# Altium schematic sheet BM22192DA06_SCH.SchDoc
size 594 x 420 mm; SheetNumber: 1; SheetTotal: 1
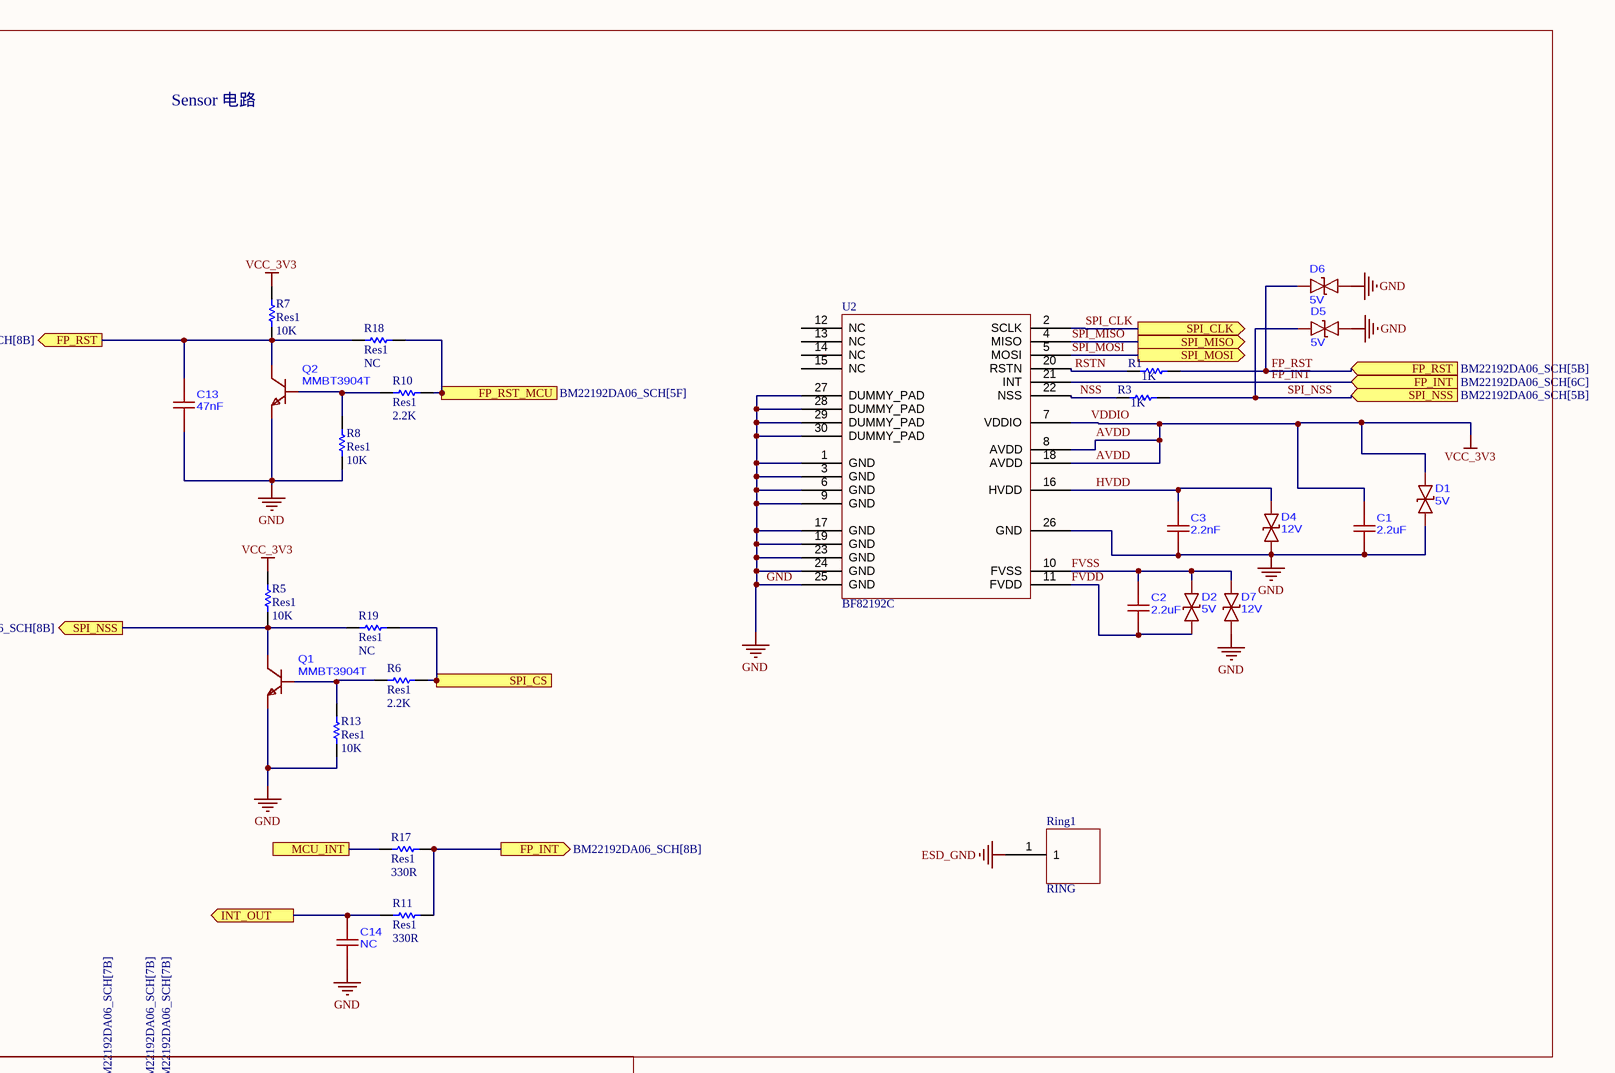
[diagram p0: BM22192DA06_SCH.SchDoc, top right]
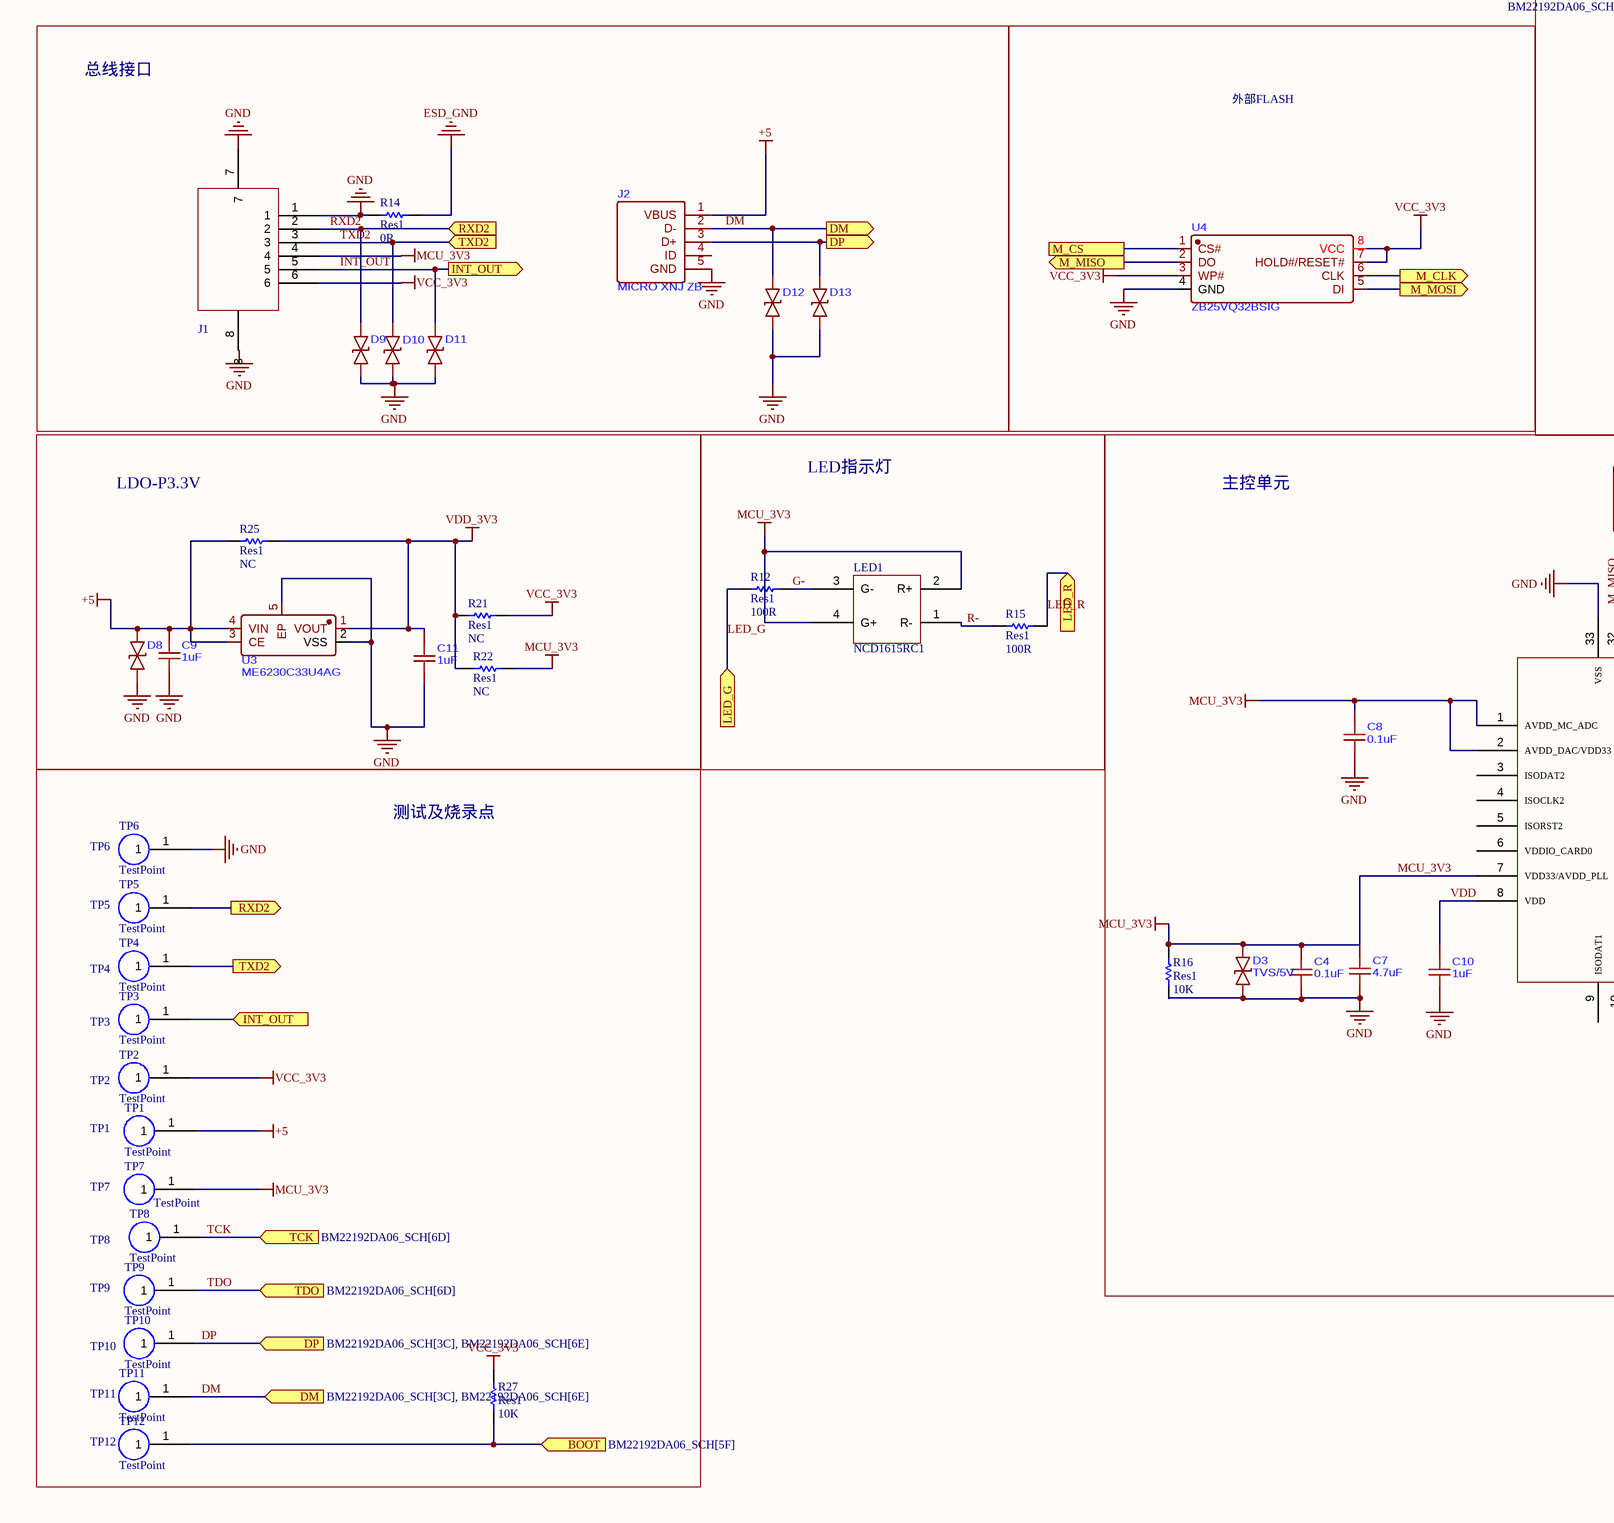
[diagram p1: BM22192DA06_SCH.SchDoc, bottom left]
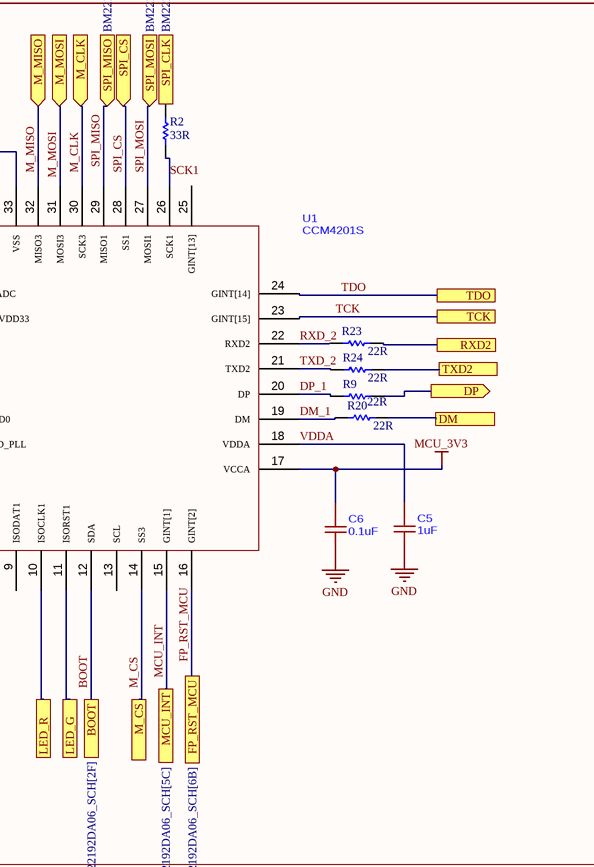
[diagram p2: BM22192DA06_SCH.SchDoc, bottom right]

## Parts
C1  2.2uF  [C0201]
C2  2.2uF  [C0201]
C3  2.2nF  [C0201]
C4  0.1uF  [C0201]
C5  1uF  [C0402]
C6  0.1uF  [C0201]
C7  4.7uF  [C0402]
C8  0.1uF  [C0201]
C9  1uF  [C0402]
C10  1uF  [C0402]
C11  1uF  [C0402]
C13  47nF  [C0201]
C14  NC  [C0201]
D1  5V  [D0201-BI_A]
D2  5V  [D0201-BI_A]
D3  TVS/5V  [D0201-BI_A]
D4  12V  [D0201-BI_A]
D5  5V  [D0201-BI_A]
D6  5V  [D0201-BI_A]
D7  12V  [D0201-BI_A]
D8  RSFK9D3NT  [D0201-BI_A]  (value not drawn)
D9  RSFK9D3NT  [D0201-BI_A]  (value not drawn)
D10  RSFK9D3NT  [D0201-BI_A]  (value not drawn)
D11  RSFK9D3NT  [D0201-BI_A]  (value not drawn)
D12  RSFK9D3NT  [D0201-BI_A]  (value not drawn)
D13  RSFK9D3NT  [D0201-BI_A]  (value not drawn)
J1  SM06B-GHS-TB(LF)(SN)  [CONN_SM06B-GHS-TB_JST]  (value not drawn)
J2  MICRO XNJ ZB  [MICRO-USB-SMD_MICRO-XNJ-ZB]
LED1  NCD1615RC1  [LED-SMD_4P-L1.6-W1.5-TL-1]
Q1  MMBT3904T  [SOT-523-3_L1.6-W0.8-P1.00-LS1.6-BR]
Q2  MMBT3904T  [SOT-523-3_L1.6-W0.8-P1.00-LS1.6-BR]
R1  value 1K  [R0201]  (hidden comment: Res1)
R2  value 33R  [R0201]  (hidden comment: Res1)
R3  value 1K  [R0201]  (hidden comment: Res1)
R5  Res1  value 10K  [R0201]
R6  Res1  value 2.2K  [R0201]
R7  Res1  value 10K  [R0201]
R8  Res1  value 10K  [R0201]
R9  value 22R  [R0201]  (hidden comment: Res1)
R10  Res1  value 2.2K  [R0201]
R11  Res1  value 330R  [R0201]
R12  Res1  value 100R  [R0201]
R13  Res1  value 10K  [R0201]
R14  Res1  value 0R  [R0201]
R15  Res1  value 100R  [R0201]
R16  Res1  value 10K  [R0201]
R17  Res1  value 330R  [R0201]
R18  Res1  value NC  [R0201]
R19  Res1  value NC  [R0201]
R20  value 22R  [R0201]  (hidden comment: Res1)
R21  Res1  value NC  [R0201]
R22  Res1  value NC  [R0201]
R23  value 22R  [R0201]  (hidden comment: Res1)
R24  value 22R  [R0201]  (hidden comment: Res1)
R25  Res1  value NC  [R0201]
R27  Res1  value 10K  [R0201]
Ring1  RING  [金属环]
TP1  TestPoint  [TestPoint]
TP2  TestPoint  [TestPoint]
TP3  TestPoint  [TestPoint]
TP4  TestPoint  [TestPoint]
TP5  TestPoint  [TestPoint]
TP6  TestPoint  [TestPoint]
TP7  TestPoint  [TestPoint]
TP8  TestPoint  [TestPoint]
TP9  TestPoint  [TestPoint]
TP10  TestPoint  [TestPoint]
TP11  TestPoint  [TestPoint]
TP12  TestPoint  [TestPoint]
U1  CCM4201S  [QFN40P400X400X85_HS-33N]
U2  BF82192C  [BF82192c]
U3  ME6230C33U4AG  [FBP4L_L1.0-W1.0-P0.65-BL-EP]
U4  ZB25VQ32BSIG  [SOIJ-8_L5.3-W5.3-P1.27-LS7.9-BL]

## Blocks framed on the sheet
Sensor 电路: C1-C3 C13 C14 D1 D2 D4-D7 Q1 Q2 R1 R3 R5-R8 R10 R11 R13 R17-R19 Ring1 U2
总线接口: D9-D13 J1 J2 R14
外部FLASH: U4
LDO-P3.3V: C9 C11 D8 R21 R22 R25 U3
LED指示灯: LED1 R12 R15
主控单元: C4-C8 C10 D3 R2 R9 R16 R20 R23 R24 U1
测试及烧录点: R27 TP1-TP12

## Ports
BOOT (in, see BM22192DA06_SCH[5F]), BOOT (see BM22192DA06_SCH[2F]), DM (in, see BM22192DA06_SCH[3C], BM22192DA06_SCH[6E]), DM (out, see BM22192DA06_SCH[1F], BM22192DA06_SCH[6E]), DM (see BM22192DA06_SCH[1F], BM22192DA06_SCH[3C]), DP (in, see BM22192DA06_SCH[3C], BM22192DA06_SCH[6E]), DP (out, see BM22192DA06_SCH[1F], BM22192DA06_SCH[3C]), DP (out, see BM22192DA06_SCH[1F], BM22192DA06_SCH[6E]), FP_INT (in, see BM22192DA06_SCH[6C]), FP_INT (out, see BM22192DA06_SCH[8B]), FP_RST (in, see BM22192DA06_SCH[5B]), FP_RST (out, see BM22192DA06_SCH[8B]), FP_RST_MCU (see BM22192DA06_SCH[5F]), FP_RST_MCU (see BM22192DA06_SCH[6B]), INT_OUT (in, see BM22192DA06_SCH[2C], BM22192DA06_SCH[5C]), INT_OUT (out, see BM22192DA06_SCH[1E], BM22192DA06_SCH[2C]), INT_OUT (out, see BM22192DA06_SCH[1E], BM22192DA06_SCH[5C]), LED_G (in, see BM22192DA06_SCH[5F]), LED_G (see BM22192DA06_SCH[2D]), LED_R (in, see BM22192DA06_SCH[5F]), LED_R (see BM22192DA06_SCH[3D]), M_CLK (in, see BM22192DA06_SCH[4C]), M_CLK (out, see BM22192DA06_SCH[5D]), M_CS (see BM22192DA06_SCH[3C]), M_CS (see BM22192DA06_SCH[5F]), M_MISO (in, see BM22192DA06_SCH[3C]), M_MISO (out, see BM22192DA06_SCH[5D]), M_MOSI (in, see BM22192DA06_SCH[4C]), M_MOSI (out, see BM22192DA06_SCH[5D]), MCU_INT (see BM22192DA06_SCH[5C]), MCU_INT (see BM22192DA06_SCH[5F]), RXD2 (in, see BM22192DA06_SCH[1E], BM22192DA06_SCH[6E]), RXD2 (out, see BM22192DA06_SCH[2C], BM22192DA06_SCH[6E]), RXD2 (see BM22192DA06_SCH[1E], BM22192DA06_SCH[2C]), SPI_CLK (in, see BM22192DA06_SCH[7B]), SPI_CLK (out, see BM22192DA06_SCH[5D]), SPI_CS (in, see BM22192DA06_SCH[6C]), SPI_CS (out, see BM22192DA06_SCH[5D]), SPI_MISO (in, see BM22192DA06_SCH[7B]), SPI_MISO (out, see BM22192DA06_SCH[5D]), SPI_MOSI (in, see BM22192DA06_SCH[7B]), SPI_MOSI (out, see BM22192DA06_SCH[5D]), SPI_NSS (in, see BM22192DA06_SCH[5B]), SPI_NSS (out, see BM22192DA06_SCH[8B]), TCK (in, see BM22192DA06_SCH[6D]), TCK (see BM22192DA06_SCH[1F]), TDO (in, see BM22192DA06_SCH[6D]), TDO (see BM22192DA06_SCH[1F]), TXD2 (in, see BM22192DA06_SCH[1E], BM22192DA06_SCH[6E]), TXD2 (out, see BM22192DA06_SCH[2C], BM22192DA06_SCH[6E]), TXD2 (see BM22192DA06_SCH[1E], BM22192DA06_SCH[2C])

## Nets
+5: C9.2 D8.2(A) J2.1(VBUS) R25.1 TP1.1 U3.3(CE) U3.4(VIN)
AVDD: C1.2 D1.1(K) J1.6 R5.1 R7.1 R21.2 R27.2 TP2.1 U2.7(VDDIO) U2.8(AVDD) U2.18(AVDD) U4.3(WP#) U4.7(HOLD#/RESET#) U4.8(VCC)  [also labelled VCC_3V3, VDDIO]
ESD_GND: R14.2 Ring1.1
GND: C1.1 C3.1 C4.1 C5.1 C6.1 C7.1 C8.1 C9.1 C10.1 C11.1 C13.1 C14.1 D1.2(A) D3.1(K) D4.1(K) D5.1(K) D6.1(K) D7.1(K) D8.1(K) D9.1(K) D10.2(A) D11.2(A) D12.1(K) D13.1(K) J1.1 J1.7 J2.5(GND) Q1.2(E) Q2.2(E) R8.2 R13.2 R14.1 R16.2 TP6.1 U1.33(VSS) U2.1(GND) U2.3(GND) U2.6(GND) U2.9(GND) U2.17(GND) U2.19(GND) U2.23(GND) U2.24(GND) U2.25(GND) U2.26(GND) U2.27(DUMMY_PAD) U2.28(DUMMY_PAD) U2.29(DUMMY_PAD) U2.30(DUMMY_PAD) U3.2(VSS) U3.5(EP) U4.4(GND)
MCU_3V3: C4.2 C6.2 C7.2 C8.2 D3.2(A) J1.4 LED1.2(R+) LED1.4(G+) R16.1 R22.2 TP7.1 U1.1(AVDD_MC_ADC) U1.2(AVDD_DAC/VDD33) U1.7(VDD33/AVDD_PLL) U1.17(VCCA)
VDD_3V3: C11.2 R21.1 R22.1 R25.2 U3.1(VOUT)
BOOT: R27.1 TP12.1 U1.12(SDA) ; port BOOT
DM: D12.2(A) J2.2(D-) R20.1 TP11.1 ; port DM
DM_1: R20.2 U1.19(DM)
DP: D13.2(A) J2.3(D+) R9.1 TP10.1 ; port DP
DP_1: R9.2 U1.20(DP)
FP_INT: R11.2 R17.2 U2.21(INT) ; port FP_INT
FP_RST: C13.2 D6.2(A) Q2.3(C) R1.2 R7.2 R18.1 ; port FP_RST
FP_RST_MCU: R10.2 R18.2 U1.16(GINT[2]) ; port FP_RST_MCU
FVDD: C2.1 D2.1(K) U2.11(FVDD)
FVSS: C2.2 D2.2(A) D7.2(A) U2.10(FVSS)
G-: LED1.3(G-) R12.2
HVDD: C3.2 D4.2(A) U2.16(HVDD)
INT_OUT: C14.2 D11.1(K) J1.5 R11.1 TP3.1 ; port INT_OUT
LED_G: R12.1 U1.11(ISORST1) ; port LED_G
LED_R: R15.2 U1.10(ISOCLK1) ; port LED_R
M_CLK: U1.30(SCK3) U4.6(CLK) ; port M_CLK
M_CS: U1.14(SS3) U4.1(CS#) ; port M_CS
M_MISO: U1.32(MISO3) U4.2(DO) ; port M_MISO
M_MOSI: U1.31(MOSI3) U4.5(DI) ; port M_MOSI
MCU_INT: R17.1 U1.15(GINT[1]) ; port MCU_INT
NSS: R3.1 U2.22(NSS)
R-: LED1.1(R-) R15.1
RSTN: R1.1 U2.20(RSTN)
RXD2: D9.2(A) J1.2 R23.1 TP5.1 ; port RXD2
RXD_2: R23.2 U1.22(RXD2)
SCK1: R2.2 U1.26(SCK1)
SPI_CLK: R2.1 U2.2(SCLK) ; port SPI_CLK
SPI_CS: R6.2 R19.2 U1.28(SS1) ; port SPI_CS
SPI_MISO: U1.29(MISO1) U2.4(MISO) ; port SPI_MISO
SPI_MOSI: U1.27(MOSI1) U2.5(MOSI) ; port SPI_MOSI
SPI_NSS: D5.2(A) Q1.3(C) R3.2 R5.2 R19.1 ; port SPI_NSS
TCK: TP8.1 U1.23(GINT[15]) ; port TCK
TDO: TP9.1 U1.24(GINT[14]) ; port TDO
TXD2: D10.1(K) J1.3 R24.1 TP4.1 ; port TXD2
TXD_2: R24.2 U1.21(TXD2)
VDD: C10.2 U1.8(VDD)
VDDA: C5.2 U1.18(VDDA)
NetQ1_1: Q1.1(B) R6.1 R13.1
NetQ2_1: Q2.1(B) R8.1 R10.1

Not connected (* = marked no-connect by the designer): J1 8; J2 4(ID); U1 3(ISODAT2) 4(ISOCLK2) 5(ISORST2) 6(VDDIO_CARD0) 9(ISODAT1) 13(SCL) 25(GINT[13]); U2 12(NC) 13(NC) 14(NC) 15(NC)

## Notes on the sheet
- (near TP6) TP6
- TP5
- TP4
- TP3
- TP2
- TP1
- TP7
- TP8
- TP9
- TP10
- TP11
- TP12
- Labels drawn without touching a wire or pin: GND
- DWG NO:
- REV:
- THIS DOCUMENT AND THE DATA DISCLOSED HEREIN OR
- HEREWITH IS THE PROPERTY OF ALTIUM LIMITED AND MAY
- BE FREELY DISTRIBUTED IN WHOLE. NO RIGHTS ARE
- RESERVED OR EXPRESS OR IMPLIED WARANTEE GIVEN.
- REVISION
- DESCRIPTION
- DATE
- APPROVED
- ENG:
- APPROVALS
- PROJECT
- DSN:
- CHK:
- REFERENCE DOCUMENTS
- PROJECT REVISION:
- TITLE
- DOCUMENT REVISION:
- DESIGN ITEM:
- BOM:
- FAB DWG:
- PCB DWG:
- ASSY DWG:
- SCALE:
- A2
- SIZE
- CAGE CODE
- FILE NAME
- DWG NO.
- SHEET
- OF
- REV

## Library data of the parts
C1-C4 C6 C8 C13 C14 = C0201: CAP
C5 C9-C11 = C0201: Parameter 1: 1uF
C7 = C0201: Parameter 1: 1uF
D1-D8 = RSFK9D3NT: TVS
J1 = SM06B-GHS-TBLFSN: Description
LED1 = NCD1615RC1: LED
Q1 Q2 = MMBT3904T: NPN triode
R1-R3 R5-R25 R27 = Res1: Resistor; Published: 8-Jun-2000; LatestRevisionDate: 17-Jul-2002; LatestRevisionNote: Re-released for DXP Platform.; PackageReference: AXIAL-0.3; Publisher: Altium Limited; PackageDescription: Axial Device, Thru-Hole; 2 Leads; 0.3 in Pin Spacing
Ring1 = RING: Metal Ring
U3 = ME6230C33U4AG: LDO